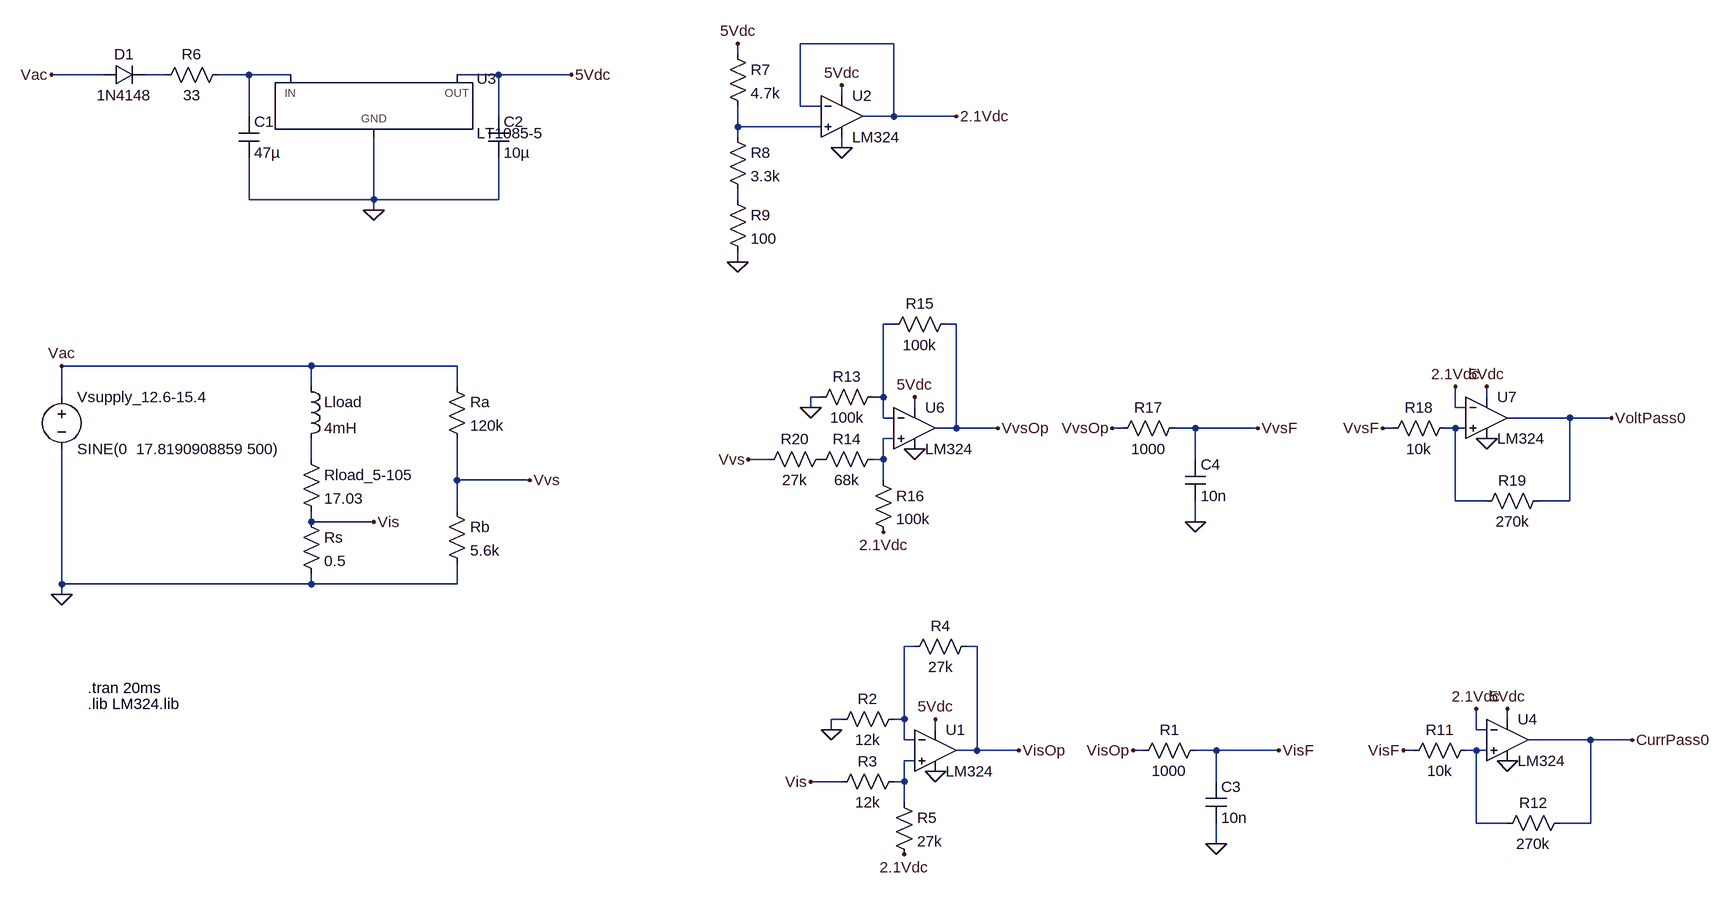
[diagram p0: schematic LTspice Simulation.asc]
LTspice Simulation.asc, the LTspice schematic file:
Version 4.1
SHEET 1 2524 1340
WIRE 960 -672 816 -672
WIRE 720 -656 720 -672
WIRE -256 -624 -336 -624
WIRE -160 -624 -192 -624
WIRE -32 -624 -80 -624
WIRE 32 -624 -32 -624
WIRE 352 -624 288 -624
WIRE 464 -624 352 -624
WIRE 880 -592 880 -608
WIRE 816 -576 816 -672
WIRE 848 -576 816 -576
WIRE -32 -560 -32 -624
WIRE 352 -560 352 -624
WIRE 960 -560 960 -672
WIRE 960 -560 912 -560
WIRE 1056 -560 960 -560
WIRE 720 -544 720 -576
WIRE 848 -544 720 -544
WIRE 720 -528 720 -544
WIRE 880 -512 880 -528
WIRE -32 -432 -32 -496
WIRE 160 -432 160 -528
WIRE 160 -432 -32 -432
WIRE 352 -432 352 -496
WIRE 352 -432 160 -432
WIRE 720 -432 720 -448
WIRE 160 -416 160 -432
WIRE 720 -336 720 -352
WIRE 960 -240 944 -240
WIRE 1056 -240 1040 -240
WIRE 64 -176 -320 -176
WIRE 288 -176 64 -176
WIRE 64 -144 64 -176
WIRE 288 -144 288 -176
WIRE -320 -128 -320 -176
WIRE 848 -128 832 -128
WIRE 944 -128 944 -240
WIRE 944 -128 928 -128
WIRE 1872 -128 1872 -144
WIRE 832 -112 832 -128
WIRE 992 -112 992 -128
WIRE 1824 -112 1824 -144
WIRE 1840 -112 1824 -112
WIRE 944 -96 944 -128
WIRE 960 -96 944 -96
WIRE 2000 -96 1904 -96
WIRE 2064 -96 2000 -96
WIRE 1056 -80 1056 -240
WIRE 1056 -80 1024 -80
WIRE 1120 -80 1056 -80
WIRE 1312 -80 1296 -80
WIRE 1424 -80 1392 -80
WIRE 1520 -80 1424 -80
WIRE 1728 -80 1712 -80
WIRE 1824 -80 1808 -80
WIRE 1840 -80 1824 -80
WIRE 960 -64 944 -64
WIRE 64 -32 64 -64
WIRE 768 -32 736 -32
WIRE 944 -32 944 -64
WIRE 944 -32 928 -32
WIRE 1424 -32 1424 -80
WIRE 288 0 288 -64
WIRE 400 0 288 0
WIRE 944 0 944 -32
WIRE 1824 32 1824 -80
WIRE 1872 32 1824 32
WIRE 2000 32 2000 -96
WIRE 2000 32 1952 32
WIRE 288 48 288 0
WIRE 64 64 64 48
WIRE 160 64 64 64
WIRE 1424 64 1424 32
WIRE -320 160 -320 -48
WIRE 64 160 64 144
WIRE 64 160 -320 160
WIRE 288 160 288 128
WIRE 288 160 64 160
WIRE -320 176 -320 160
WIRE 992 256 976 256
WIRE 1088 256 1072 256
WIRE 880 368 864 368
WIRE 976 368 976 256
WIRE 976 368 960 368
WIRE 1904 368 1904 352
WIRE 864 384 864 368
WIRE 1024 384 1024 368
WIRE 1856 384 1856 352
WIRE 1872 384 1856 384
WIRE 976 400 976 368
WIRE 992 400 976 400
WIRE 2032 400 1936 400
WIRE 2096 400 2032 400
WIRE 1088 416 1088 256
WIRE 1088 416 1056 416
WIRE 1152 416 1088 416
WIRE 1344 416 1328 416
WIRE 1456 416 1424 416
WIRE 1552 416 1456 416
WIRE 1760 416 1744 416
WIRE 1856 416 1840 416
WIRE 1872 416 1856 416
WIRE 992 432 976 432
WIRE 880 464 832 464
WIRE 976 464 976 432
WIRE 976 464 960 464
WIRE 1456 464 1456 416
WIRE 976 496 976 464
WIRE 1856 528 1856 416
WIRE 1904 528 1856 528
WIRE 2032 528 2032 400
WIRE 2032 528 1984 528
WIRE 1456 560 1456 528
FLAG 160 64 Vis
FLAG 400 0 Vvs
FLAG -320 176 0
FLAG -320 -176 Vac
FLAG -336 -624 Vac
FLAG 464 -624 5Vdc
FLAG 160 -416 0
FLAG 1024 368 5Vdc
FLAG 864 384 0
FLAG 832 464 Vis
FLAG 720 -336 0
FLAG 976 576 2.1Vdc
FLAG 1024 448 0
FLAG 720 -672 5Vdc
FLAG 880 -608 5Vdc
FLAG 880 -512 0
FLAG 1056 -560 2.1Vdc
FLAG 1456 560 0
FLAG 1552 416 VisF
FLAG 1152 416 VisOp
FLAG 1328 416 VisOp
FLAG 1904 432 0
FLAG 1904 352 5Vdc
FLAG 1856 352 2.1Vdc
FLAG 2096 400 CurrPass0
FLAG 992 -128 5Vdc
FLAG 832 -112 0
FLAG 736 -32 Vvs
FLAG 944 80 2.1Vdc
FLAG 992 -48 0
FLAG 1424 64 0
FLAG 1520 -80 VvsF
FLAG 1120 -80 VvsOp
FLAG 1296 -80 VvsOp
FLAG 1872 -64 0
FLAG 1872 -144 5Vdc
FLAG 1824 -144 2.1Vdc
FLAG 2064 -96 VoltPass0
FLAG 1744 416 VisF
FLAG 1712 -80 VvsF
SYMBOL voltage -320 -144 R0
WINDOW 123 0 0 Left 0
WINDOW 39 0 0 Left 0
SYMATTR InstName Vsupply_12.6-15.4
SYMATTR Value SINE(0  17.8190908859 500)
SYMBOL ind 48 -160 R0
SYMATTR InstName Lload
SYMATTR Value 4mH
SYMATTR SpiceLine Rser=1m
SYMBOL res 48 -48 R0
SYMATTR InstName Rload_5-105
SYMATTR Value 17.03
SYMBOL res 272 -160 R0
SYMATTR InstName Ra
SYMATTR Value 120k
SYMBOL res 272 32 R0
SYMATTR InstName Rb
SYMATTR Value 5.6k
SYMBOL res 48 48 R0
SYMATTR InstName Rs
SYMATTR Value 0.5
SYMBOL res 976 352 R90
WINDOW 0 0 56 VBottom 2
WINDOW 3 32 56 VTop 2
SYMATTR InstName R2
SYMATTR Value 12k
SYMBOL res 976 448 R90
WINDOW 0 0 56 VBottom 2
WINDOW 3 32 56 VTop 2
SYMATTR InstName R3
SYMATTR Value 12k
SYMBOL res 1088 240 R90
WINDOW 0 0 56 VBottom 2
WINDOW 3 32 56 VTop 2
SYMATTR InstName R4
SYMATTR Value 27k
SYMBOL res 960 480 R0
SYMATTR InstName R5
SYMATTR Value 27k
SYMBOL diode -256 -608 R270
WINDOW 0 32 32 VTop 2
WINDOW 3 0 32 VBottom 2
SYMATTR InstName D1
SYMATTR Value 1N4148
SYMBOL res -64 -640 R90
WINDOW 0 0 56 VBottom 2
WINDOW 3 32 56 VTop 2
SYMATTR InstName R6
SYMATTR Value 33
SYMBOL cap -48 -560 R0
SYMATTR InstName C1
SYMATTR Value 47µ
SYMBOL cap 336 -560 R0
SYMATTR InstName C2
SYMATTR Value 10µ
SYMBOL PowerProducts\\LT1085-5 160 -624 R0
SYMATTR InstName U3
SYMBOL res 704 -672 R0
SYMATTR InstName R7
SYMATTR Value 4.7k
SYMBOL res 704 -544 R0
SYMATTR InstName R8
SYMATTR Value 3.3k
SYMBOL OpAmps\\opamp2 1024 352 R0
SYMATTR InstName U1
SYMATTR Value LM324
SYMBOL res 704 -448 R0
SYMATTR InstName R9
SYMATTR Value 100
SYMBOL OpAmps\\opamp2 880 -624 R0
SYMATTR InstName U2
SYMATTR Value LM324
SYMBOL res 1440 400 R90
WINDOW 0 0 56 VBottom 2
WINDOW 3 32 56 VTop 2
SYMATTR InstName R1
SYMATTR Value 1000
SYMBOL cap 1440 464 R0
SYMATTR InstName C3
SYMATTR Value 10n
SYMBOL OpAmps\\opamp2 1904 336 R0
SYMATTR InstName U4
SYMATTR Value LM324
SYMBOL res 1856 400 R90
WINDOW 0 0 56 VBottom 2
WINDOW 3 32 56 VTop 2
SYMATTR InstName R11
SYMATTR Value 10k
SYMBOL res 2000 512 R90
WINDOW 0 0 56 VBottom 2
WINDOW 3 32 56 VTop 2
SYMATTR InstName R12
SYMATTR Value 270k
SYMBOL res 944 -144 R90
WINDOW 0 0 56 VBottom 2
WINDOW 3 32 56 VTop 2
SYMATTR InstName R13
SYMATTR Value 100k
SYMBOL res 944 -48 R90
WINDOW 0 0 56 VBottom 2
WINDOW 3 32 56 VTop 2
SYMATTR InstName R14
SYMATTR Value 68k
SYMBOL res 1056 -256 R90
WINDOW 0 0 56 VBottom 2
WINDOW 3 32 56 VTop 2
SYMATTR InstName R15
SYMATTR Value 100k
SYMBOL res 928 -16 R0
SYMATTR InstName R16
SYMATTR Value 100k
SYMBOL OpAmps\\opamp2 992 -144 R0
SYMATTR InstName U6
SYMATTR Value LM324
SYMBOL res 1408 -96 R90
WINDOW 0 0 56 VBottom 2
WINDOW 3 32 56 VTop 2
SYMATTR InstName R17
SYMATTR Value 1000
SYMBOL cap 1408 -32 R0
SYMATTR InstName C4
SYMATTR Value 10n
SYMBOL OpAmps\\opamp2 1872 -160 R0
SYMATTR InstName U7
SYMATTR Value LM324
SYMBOL res 1824 -96 R90
WINDOW 0 0 56 VBottom 2
WINDOW 3 32 56 VTop 2
SYMATTR InstName R18
SYMATTR Value 10k
SYMBOL res 1968 16 R90
WINDOW 0 0 56 VBottom 2
WINDOW 3 32 56 VTop 2
SYMATTR InstName R19
SYMATTR Value 270k
SYMBOL res 864 -48 R90
WINDOW 0 0 56 VBottom 2
WINDOW 3 32 56 VTop 2
SYMATTR InstName R20
SYMATTR Value 27k
TEXT -280 320 Left 2 !.tran 20ms
TEXT -280 344 Left 2 !.lib LM324.lib

The netlist it stands for:
* LTspice Simulation.asc
Vsupply_12.6-15.4 Vac 0 SINE(0  17.8190908859 500)
Lload Vac N008 4mH Rser=1m
Rload_5-105 N008 Vis 17.03
Ra Vac Vvs 120k
Rb Vvs 0 5.6k
Rs Vis 0 0.5
R2 N009 0 12k
R3 N011 Vis 12k
R4 VisOp N009 27k
R5 N011 2.1Vdc 27k
D1 Vac N001 1N4148
R6 N002 N001 33
C1 N002 0 47µ
C2 5Vdc 0 10µ
X§U3 0 5Vdc N002 LT1085-5  ; pins GND OUT IN
R7 5Vdc N003 4.7k
R8 N003 N004 3.3k
X§U1 N011 N009 5Vdc 0 VisOp LM324  ; pins In+ In- V+ V- OUT
R9 N004 0 100
X§U2 N003 2.1Vdc 5Vdc 0 2.1Vdc LM324  ; pins In+ In- V+ V- OUT
R1 VisF VisOp 1000
C3 VisF 0 10n
X§U4 N010 2.1Vdc 5Vdc 0 CurrPass0 LM324  ; pins In+ In- V+ V- OUT
R11 N010 VisF 10k
R12 CurrPass0 N010 270k
R13 N005 0 100k
R14 N007 P001 68k
R15 VvsOp N005 100k
R16 N007 2.1Vdc 100k
X§U6 N007 N005 5Vdc 0 VvsOp LM324  ; pins In+ In- V+ V- OUT
R17 VvsF VvsOp 1000
C4 VvsF 0 10n
X§U7 N006 2.1Vdc 5Vdc 0 VoltPass0 LM324  ; pins In+ In- V+ V- OUT
R18 N006 VvsF 10k
R19 VoltPass0 N006 270k
R20 P001 Vvs 27k
.model D D
.lib standard.dio
.tran 20ms
.lib LM324.lib
.backanno
.end